# EAGLE design HydraNFC_Antenna_v1.0 (EAGLE 6.5.0)
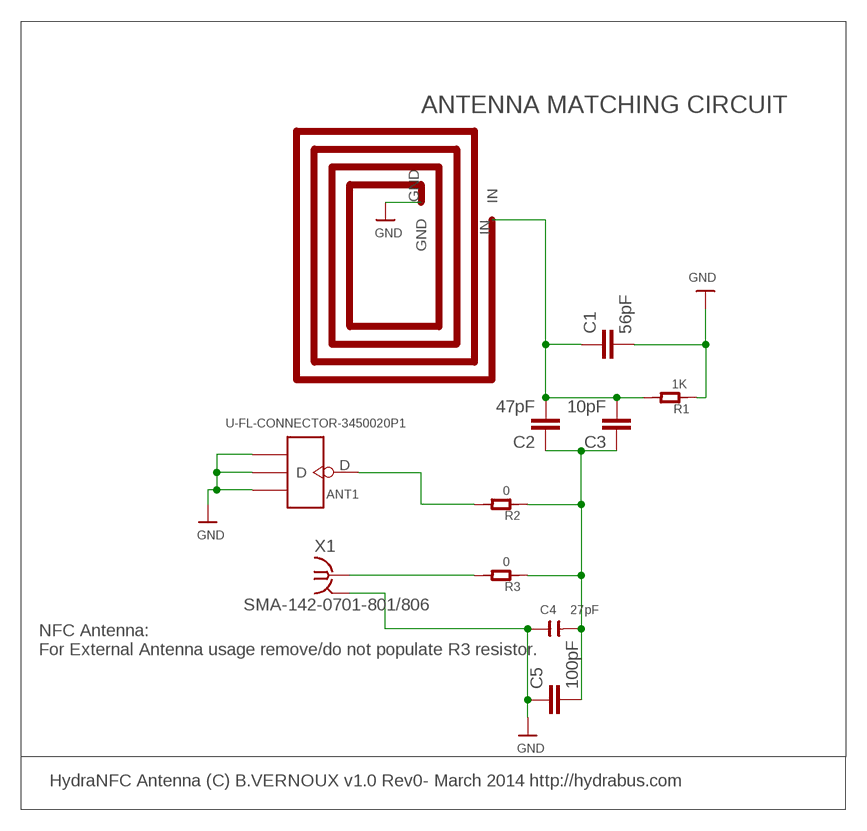
[diagram p0: schematic, sheet 1]

## Parts
ANT1  U-FL-CONNECTOR-3450020P1  [U-FL]
C1  56pF  CAPC805  [C805]
C2  47pF  CAPC805  [C805]
C3  10pF  CAPC805  [C805]
C4  27pF  C-0603  [C0603]
C5  100pF  CAPC805  [C805]
R1  1K  R-0603  [R0603]
R2  0  R-0603  [R0603]
R3  0  R-0603  [R0603]
U$43  NFC_13_56MHz_ANTENNA  TRF7970A_ANTENNA  [TRF7970A_ANTENNA]
X1  SMA-142-0701-801/806  [J502-ND-142-0701-801/806]

## Nets
GND: ANT1.GND1 ANT1.GND2 ANT1.GND3 C1.2 C4.2 C5.1 R1.2 U$43.GND X1.G@1(GND)
N$4: C2.1 C3.1 C4.1 C5.2 R2.2 R3.2
N$6: C1.1 C2.2 C3.2 R1.1 U$43.IN
N$11: R3.1 X1.1
N$20: ANT1.D R2.1

## Notes on the sheet
- ANTENNA MATCHING CIRCUIT
- NFC Antenna:
  For External Antenna usage remove/do not populate R3 resistor.
- HydraNFC Antenna (C) B.VERNOUX v1.0 Rev0- March 2014 http://hydrabus.com

## Power pins joined to a net without a drawn wire
GND: X1.G@2(GND) X1.G@3(GND) X1.G@4(GND)

## Library data of the parts
ANT1 = OPL Eagle Library:U-FL-CONNECTOR
C1-C3 C5 = dp_devices:CAP
C4 = OPL:C*; OPL: 0100410P1
R1 = OPL:R*; OPL: 0011090P1
R2 R3 = OPL:R*; OPL: 0010070P1
U$43 = 0ben:TRF7970A_ANTENNA
X1 = con-coax:SMA-: SMA 50 Ohm End Launch Jack Receptacle - Round Contact Johnson Components Source: www.johnsoncomponents.com .. J502-ND.pdf; MF: JOHNSON COMPONENTS; MPN: 142-0701-801; OC_FARNELL: 1608592; OC_NEWARK: 90F2624

## Net classes
0 default: width 0.203 mm, drill 0.33 mm, clearance 0.152 mm
1 POWER: width 0.203 mm, drill 0.33 mm, clearance 0.152 mm
2 VDD: width 0.254 mm, drill 0.33 mm, clearance 0.152 mm

## Board
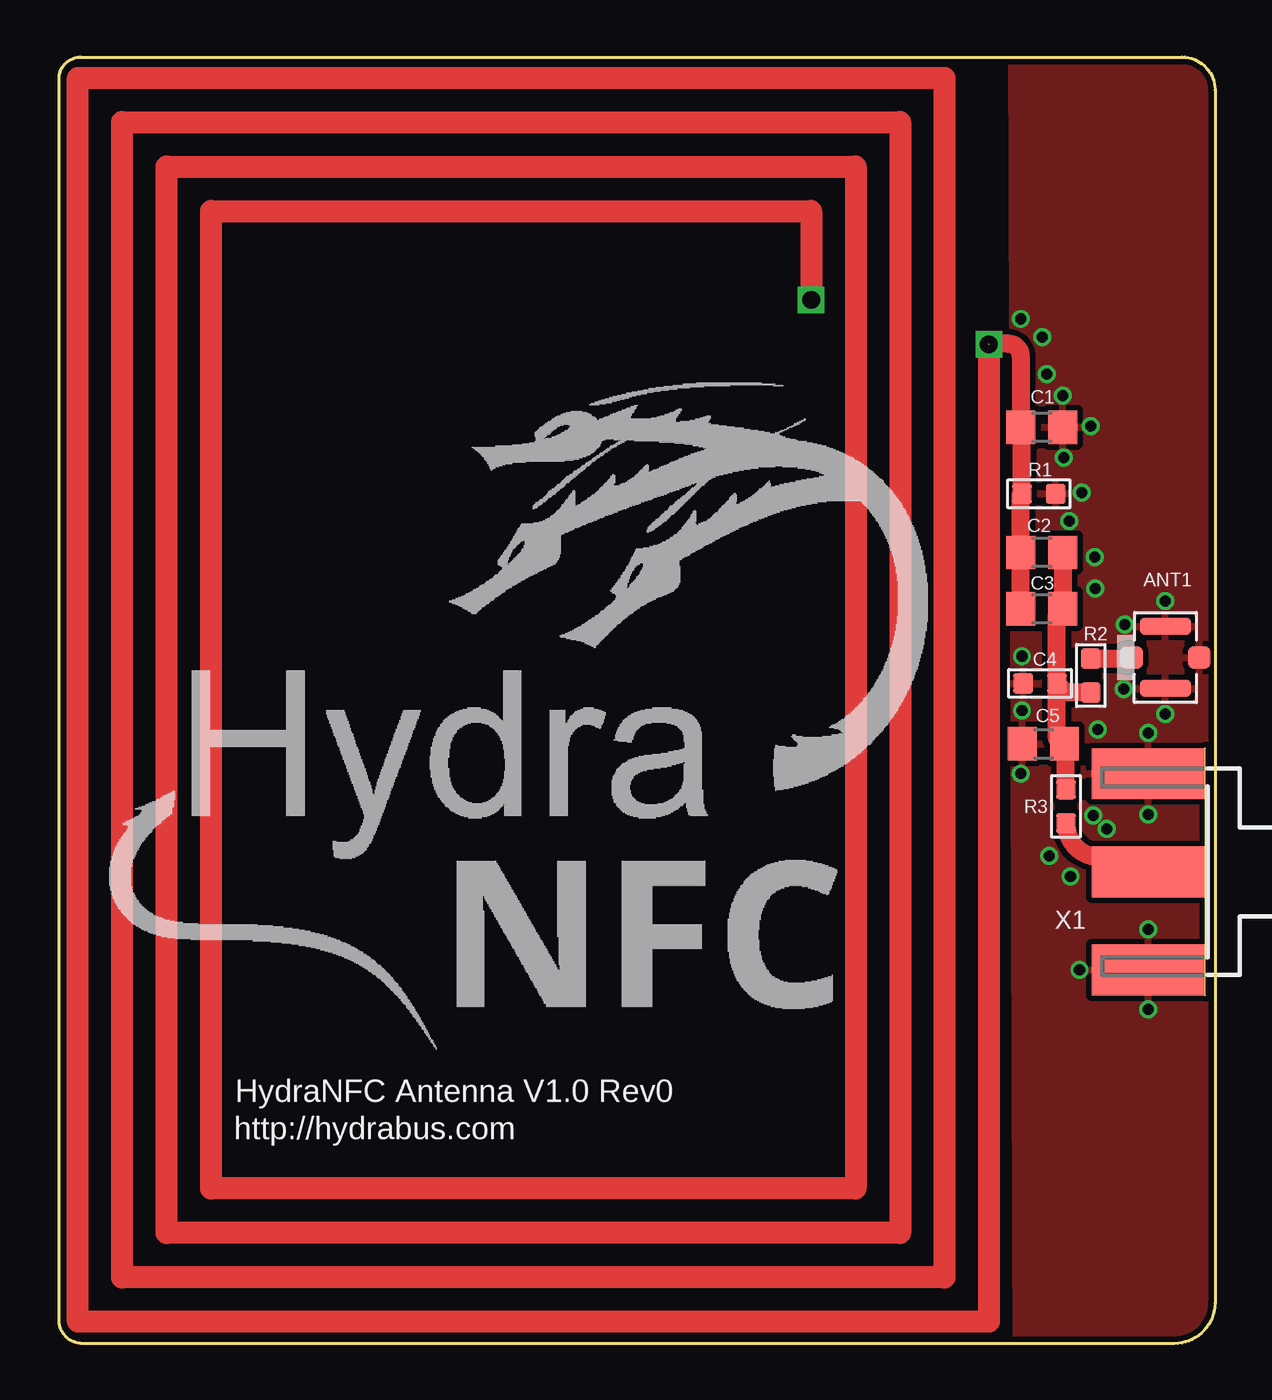
[diagram p1: board, top side]
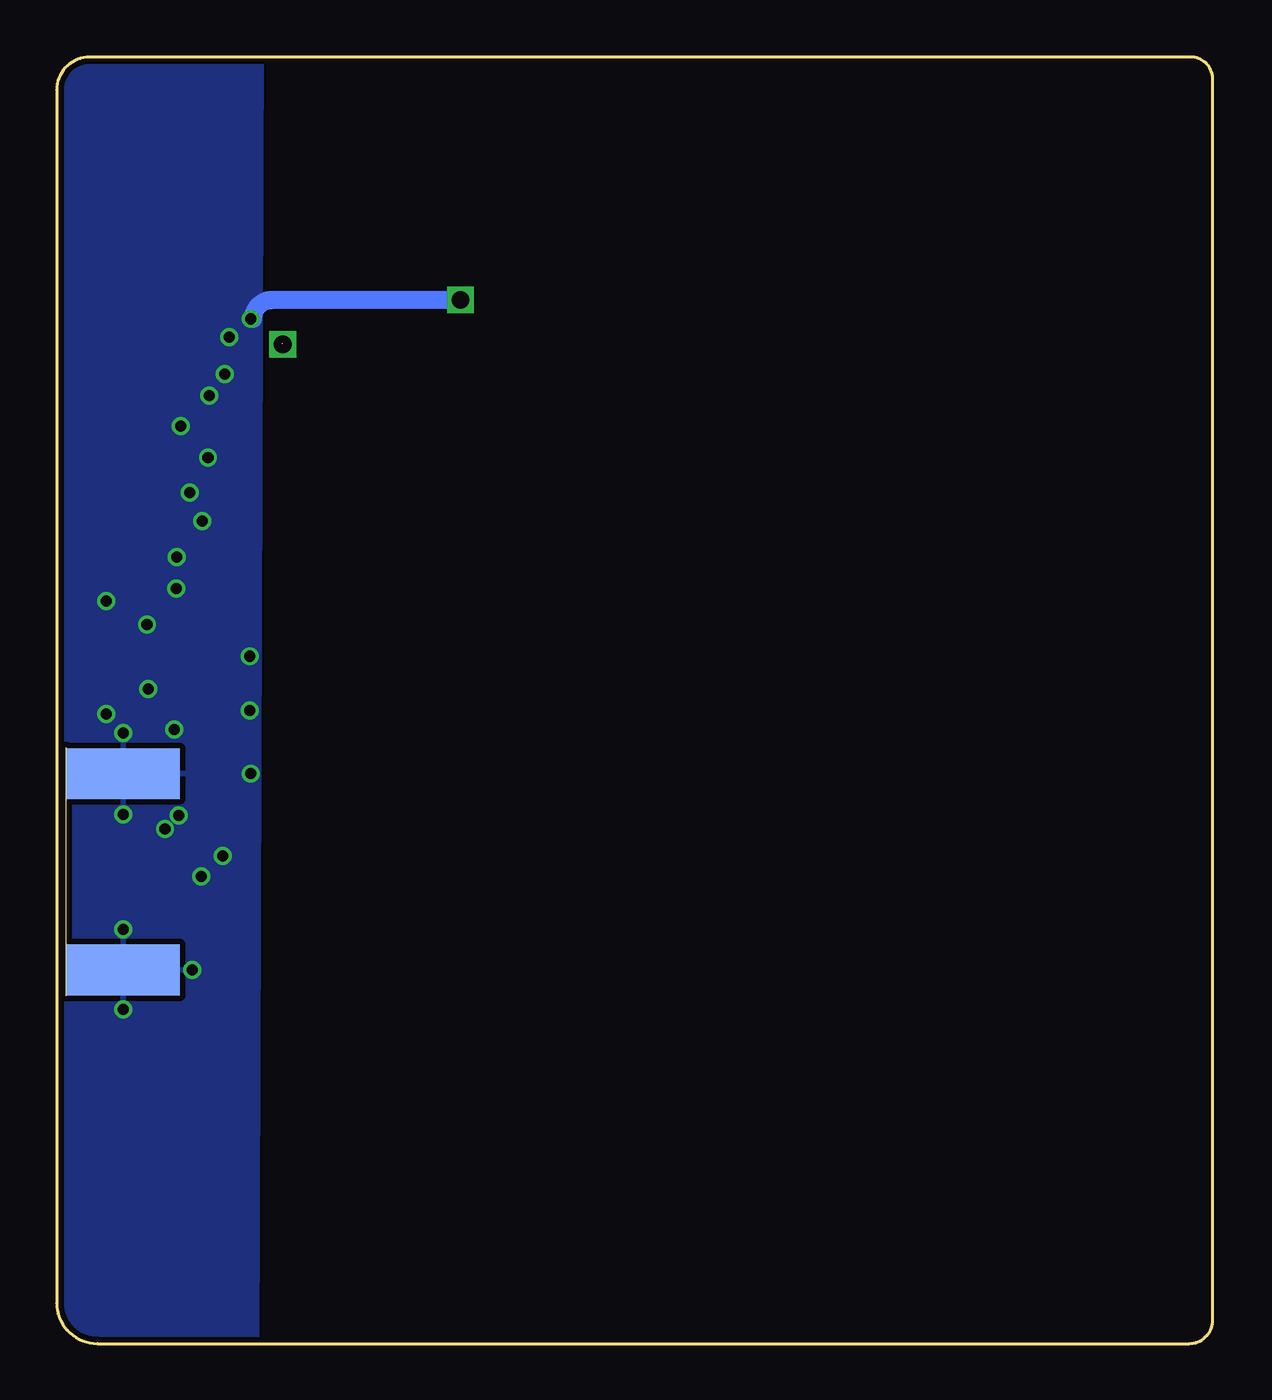
[diagram p2: board, bottom side, seen from below]

Size 52.02 x 57.91 mm. Coordinates in mm from the lower left corner, seen from the top.
Outline: 0,1.06 0,56.93 arc-90 0.98,57.91 50.54,57.91 arc-90 52.02,56.44 52.02,1.83 arc-90 50.19,0 1.06,0 arc-90 0,1.06
Copper layers (1*16): Top 0.035mm / dielectric 0.2mm / Bottom 0.035mm
Design rules "SeeedStudio_DRU_no_angle_20130527_2layers": minimum track width 6mil, minimum drill 12mil, track to track 6mil, track to pad 6mil, pad to pad 6mil, via to via 6mil, smd to smd 0mil, copper to edge 10mil, drill to drill 10mil, minimum pad ring 6mil, minimum via ring 6mil, stop-mask expansion 2mil, vias tented up to drill 25mil, thermal gap 10mil

### Footprints (pad centres in the part's own frame; a part is rotated, then mirrored left to right if it is on the bottom)
U-FL = smd 1.016 x 1.016: D -1.524,0; GND3 1.524,0 | smd 2.286 x 0.762: GND1 0,1.397; GND2 0,-1.397
C805 = smd 1.3 x 1.5: 1 -0.95,0; 2 0.95,0
C0603 = smd 0.889 x 0.889: 1 -0.762,0; 2 0.762,0
R0603 = smd 0.889 x 0.889: 1 -0.762,0; 2 0.762,0
TRF7970A_ANTENNA = drill 0.8 square: GND 18,-12; IN 16,-20
J502-ND-142-0701-801/806 = smd 5.08 x 2.286: 1 2.565,0; G@1 2.565,4.42; G@2 2.565,-4.42 | smd 5.08 x 2.286 bottom: G@3 2.565,4.42; G@4 2.565,-4.42

### Placement (x,y rotation side)
ANT1  49.78,30.89 0 top
C1  44.22,41.25 0 top
C2  44.22,35.61 180 top
C3  44.22,33.07 180 top
C4  44.15,29.72 180 top
C5  44.3,27 0 top
R1  44.09,38.25 0 top
R2  46.43,30.07 270 top
R3  45.31,24.18 90 top
U$43  21.84,28.98 90 top
X1  51.59,21.23 180 top

### Tracks (layer width: path | path; a pad name or v marks a point on that pad's centre or on a via)
GND  (via drill 0.5)
  Bottom 0.813: U$43.GND 42.32,46.98 arc-90 43.18,46.13
  other vias: 49.02,27.48 45.52,21.03 46.02,38.3 46.43,41.3 44.25,45.31 44.45,43.64 43.28,46.13 49.02,23.83 46.74,27.64 49.78,28.35 49.78,33.43 45.92,16.81 45.21,39.88 45.47,37.03 46.61,35.41 49.02,18.64 49.02,15.04 46.63,33.99 44.55,21.95 46.53,23.77 47.14,23.16 45.16,42.67 43.28,25.65 43.33,28.5 43.33,30.94 47.9,29.46 47.96,32.36
  pour Top (isolate 0.254): 42.87,58.64 52.69,58.64 52.48,-0.54 43.07,-0.75
  pour Bottom (isolate 0.203): 42.81,58.86 52.83,58.65 52.22,-0.55 43.01,-0.55
N$4
  Top 0.61: 44.91,27.23 45.25,27.23 C5.2
  Top 0.813: C4.1 44.91,32.81 C3.1 C2.1 | R3.2 45.31,26.93 C5.2 | R2.2 45.31,29.31 C4.1 | 44.91,27.23 C4.1
N$6  (1 unrouted)
  Top 0.813: 41.97,44.86 U$43.IN | 41.86,45.01 42.72,45.01 arc-90 43.27,44.46 C1.1 43.33,41.19 R1.1 43.27,38.19 C2.2 C3.2
N$11
  Top 0.406: R3.1 45.31,23.52 | 46.79,21.89 46.84,21.89 47.5,21.23 X1.1
  Top 0.813: R3.1 arc90 46.84,21.89
N$20
  Top 0.813: R2.1 48.21,30.84 ANT1.D

### Text on the board
tNames: HydraNFC Antenna V1.0 Rev0 | http://hydrabus.com